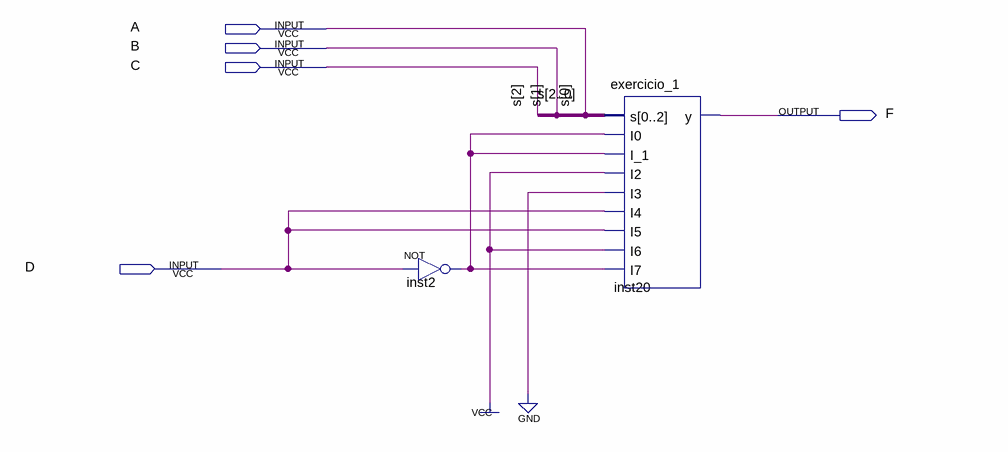
[diagram p0: schematic sheet]
// Quartus schematic Block2.bdf as structural Verilog: 2 symbols, 5 pins
module Block2 (
  input  A,
  input  B,
  input  C,
  input  D,
  output F
);

  wire inst2_out;

  not inst2 (inst2_out, D);
  exercicio_1 inst20 (
    .s({C, B, A}), .I0(inst2_out), .I_1(inst2_out), .I2(1'b1), .I3(1'b0), .I4(D), .I5(D), .I6(1'b1),
    .I7(inst2_out), .y(F));

  // Other names for the same wires on the sheet: s[2:0] = {C, B, A}
endmodule
